# Altium schematic sheet Shield.SchDoc
size A4; SheetNumber: 1; SheetTotal: 2
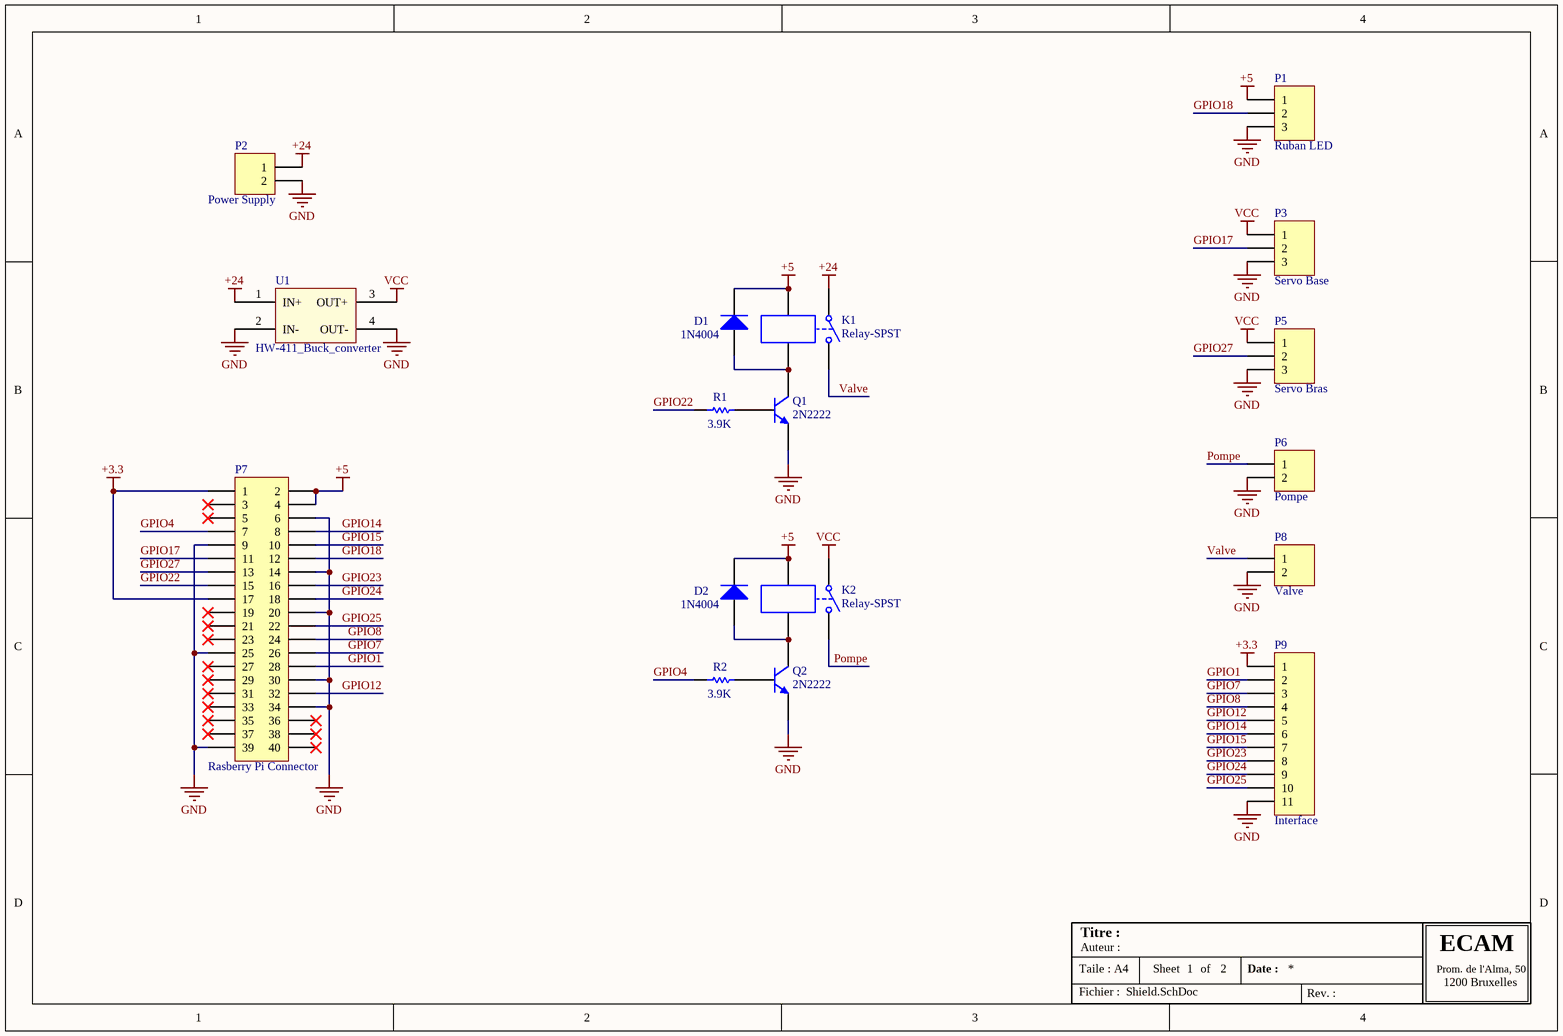
[diagram p0: Shield.SchDoc]

## Parts
D1  1N4004  [DO-41]
D2  1N4004  [DO-41]
K1  Relay-SPST  [RELAY_OJE-SH_series]
K2  Relay-SPST  [RELAY_OJE-SH_series]
P1  Ruban LED  [Conn_1X3]
P2  Power Supply  [Bornier_1X2]
P3  Servo Base  [Conn_1X3]
P5  Servo Bras  [Conn_1X3]
P6  Pompe  [Bornier_1X2]
P7  Rasberry Pi Connector  [HDR2X20]
P8  Valve  [Bornier_1X2]
P9  Interface  [Conn_1X11]
Q1  2N2222  [TO-92]
Q2  2N2222  [TO-92]
R1  value 3.9K  [AXIAL-0.3]  (hidden comment: Res1)
R2  value 3.9K  [AXIAL-0.3]  (hidden comment: Res1)
U1  HW-411_Buck_converter  [HW-411_Buck_converter]

## Nets
+3.3: P7.1 P7.17 P9.1
+5: D1.2(K) D2.2(K) K1.3 K2.3 P1.1 P7.2 P7.4
+24: K1.1 P2.1 U1.1(IN+)
GND: P1.3 P2.2 P3.3 P5.3 P6.2 P7.6 P7.9 P7.14 P7.20 P7.25 P7.30 P7.34 P7.39 P8.2 P9.11 Q1.3(E) Q2.3(E) U1.2(IN-) U1.4(OUT-)
VCC: K2.1 P3.1 P5.1 U1.3(OUT+)
GPIO1: P7.28 P9.2
GPIO4: P7.7 R2.1
GPIO7: P7.26 P9.3
GPIO8: P7.24 P9.4
GPIO12: P7.32 P9.5
GPIO14: P7.8 P9.6
GPIO15: P7.10 P9.7
GPIO17: P3.2 P7.11
GPIO18: P1.2 P7.12
GPIO22: P7.15 R1.1
GPIO23: P7.16 P9.8
GPIO24: P7.18 P9.9
GPIO25: P7.22 P9.10
GPIO27: P5.2 P7.13
Pompe: K2.2 P6.1
Valve: K1.2 P8.1
NetD1_1: D1.1(A) K1.4 Q1.1(C)
NetD2_1: D2.1(A) K2.4 Q2.1(C)
NetQ1_2: Q1.2(B) R1.2
NetQ2_2: Q2.2(B) R2.2

Not connected (* = marked no-connect by the designer): P7 3* 5* 19* 21* 23* 27* 29* 31* 33* 35* 36* 37* 38* 40*

## Notes on the sheet
- Taile : A4
- Titre :
- Auteur :
- Sheet
- of
- Date :
- Prom. de l'Alma, 50
- ECAM
- 1200 Bruxelles
- Fichier :
- Rev. :

## Library data of the parts
D1 D2 = Diode 1N4004: 1 Amp General Purpose Rectifier; Published: 8-Jun-2000; LatestRevisionDate: 17-Jul-2002; LatestRevisionNote: Re-released for DXP Platform.; DatasheetVersion: 1998; PackageVersion: Aug-1999; PackageReference: DO-41; Publisher: Altium Limited; PackageDescription: Diode, Axial; Body 5.2 x 2.7 mm (LxDia. max), Lead Dia. 0.86 mm (max); Code_JEDEC: DO-204-AL; ComponentLink1Description: Manufacturer Link; ComponentLink1URL: http://www.fairchildsemi.com/; ComponentLink2Description: Datasheet; ComponentLink2URL: http://www.fairchildsemi.com/ds/1N%2F1N4001.pdf
K1 K2 = Relay-SPST: Single-Pole Single-Throw Relay; Published: 24-Mar-1999; LatestRevisionDate: 17-Jul-2002; LatestRevisionNote: Re-released for DXP Platform.; PackageReference: MODULE4; Publisher: Altium Limited
P1 P3 P5 = Header 3: Header, 3-Pin; LatestRevisionDate: 17-Jul-2002; LatestRevisionNote: Re-released for DXP Platform.; Publisher: Altium Limited
P2 P6 P8 = Header 2: Header, 2-Pin; LatestRevisionDate: 17-Jul-2002; LatestRevisionNote: Re-released for DXP Platform.; Publisher: Altium Limited
P7 = MHDR2X20: Header, 20-Pin, Dual row; LatestRevisionDate: 17-Jul-2002; LatestRevisionNote: Re-released for DXP Platform.; Publisher: Altium Limited
P9 = Header 11: Header, 11-Pin; LatestRevisionDate: 17-Jul-2002; LatestRevisionNote: Re-released for DXP Platform.; Publisher: Altium Limited
Q1 Q2 = NPN: NPN Bipolar Transistor; Published: 8-Jun-2000; LatestRevisionDate: 17-Jul-2002; LatestRevisionNote: Re-released for DXP Platform.; PackageReference: TO-226-AA; Publisher: Altium Limited; PackageDescription: TO, Flat Index; 3 In-Line, Axial Leads; Body Dia. 4.8mm; Leads 0.55 x 0.51 mm (max); Code_JEDEC: TO-226-AA
R1 R2 = Res1: Resistor; Published: 8-Jun-2000; LatestRevisionDate: 17-Jul-2002; LatestRevisionNote: Re-released for DXP Platform.; PackageReference: AXIAL-0.3; Publisher: Altium Limited; PackageDescription: Axial Device, Thru-Hole; 2 Leads; 0.3 in Pin Spacing
U1 = HW-411_Buck_converter: Buck converter board